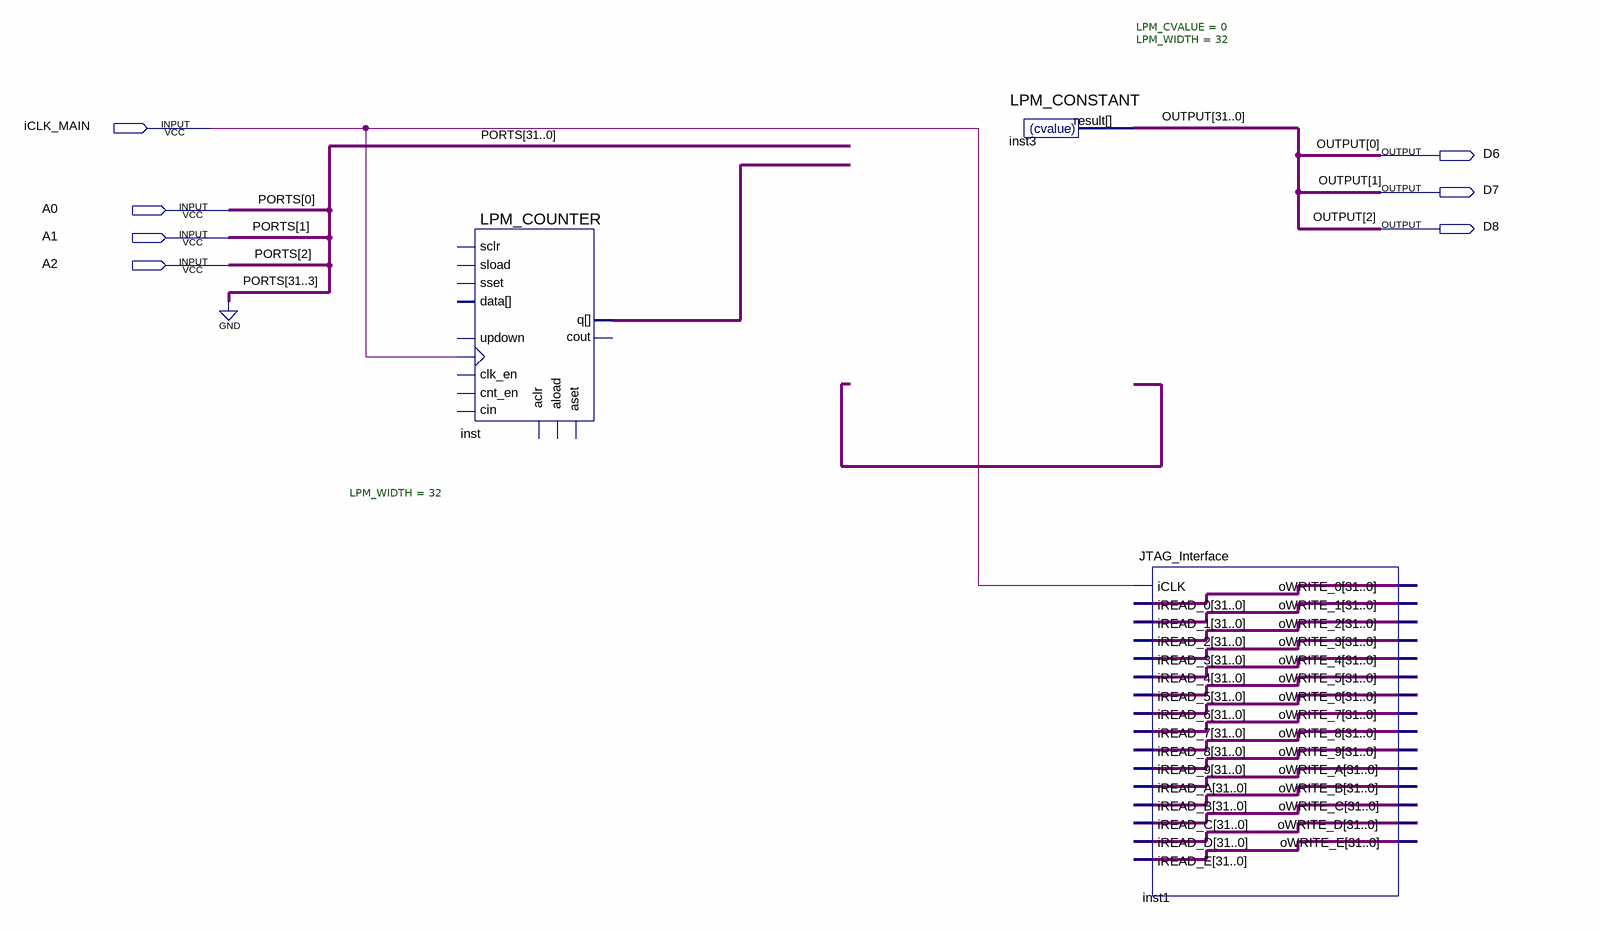
[diagram p0: schematic sheet]
// Quartus schematic MyDesign.bdf as structural Verilog: 3 symbols, 7 pins
module MyDesign (
  input  iCLK_MAIN,
  input  A0,
  input  A1,
  input  A2,
  output D6,
  output D7,
  output D8
);

  wire [31:0] inst1_owrite_0, inst1_owrite_1, inst1_owrite_2, inst1_owrite_3, inst1_owrite_4, inst1_owrite_5,
       inst1_owrite_6, inst1_owrite_7, inst1_owrite_8, inst1_owrite_9, inst1_owrite_a, inst1_owrite_b,
       inst1_owrite_c, inst1_owrite_d, inst1_owrite_e, inst_q;
  wire [31:3] OUTPUT;

  LPM_COUNTER #(.LPM_WIDTH(32)) inst (
    .clock(iCLK_MAIN), .q(inst_q));  // open: sload, data, clk_en, aload, aclr, aset, cin, sset, updown, cnt_en, sclr, cout
  LPM_CONSTANT #(.LPM_CVALUE(0), .LPM_WIDTH(32)) inst3 (.result({OUTPUT, D8, D7, D6}));
  JTAG_Interface inst1 (
    .iCLK(iCLK_MAIN), .iREAD_0(inst1_owrite_0), .iREAD_1(inst1_owrite_1), .iREAD_2(inst1_owrite_2),
    .iREAD_3(inst1_owrite_3), .iREAD_4(inst1_owrite_4), .iREAD_5(inst1_owrite_5), .iREAD_6(inst1_owrite_6),
    .iREAD_7(inst1_owrite_7), .iREAD_8(inst1_owrite_8), .iREAD_9(inst1_owrite_9), .iREAD_A(inst1_owrite_a),
    .iREAD_B(inst1_owrite_b), .iREAD_C(inst1_owrite_c), .iREAD_D(inst1_owrite_d), .iREAD_E(inst1_owrite_e),
    .oWRITE_0(inst1_owrite_0), .oWRITE_1(inst1_owrite_1), .oWRITE_2(inst1_owrite_2),
    .oWRITE_3(inst1_owrite_3), .oWRITE_4(inst1_owrite_4), .oWRITE_5(inst1_owrite_5),
    .oWRITE_6(inst1_owrite_6), .oWRITE_7(inst1_owrite_7), .oWRITE_8(inst1_owrite_8),
    .oWRITE_9(inst1_owrite_9), .oWRITE_A(inst1_owrite_a), .oWRITE_B(inst1_owrite_b),
    .oWRITE_C(inst1_owrite_c), .oWRITE_D(inst1_owrite_d), .oWRITE_E(inst1_owrite_e));

  // Other names for the same wires on the sheet: OUTPUT[2:0] = {D8, D7, D6}; PORTS[2:0] = {A2, A1, A0}
endmodule
